# EAGLE schematic Pure VCF (EAGLE 8.7.0)
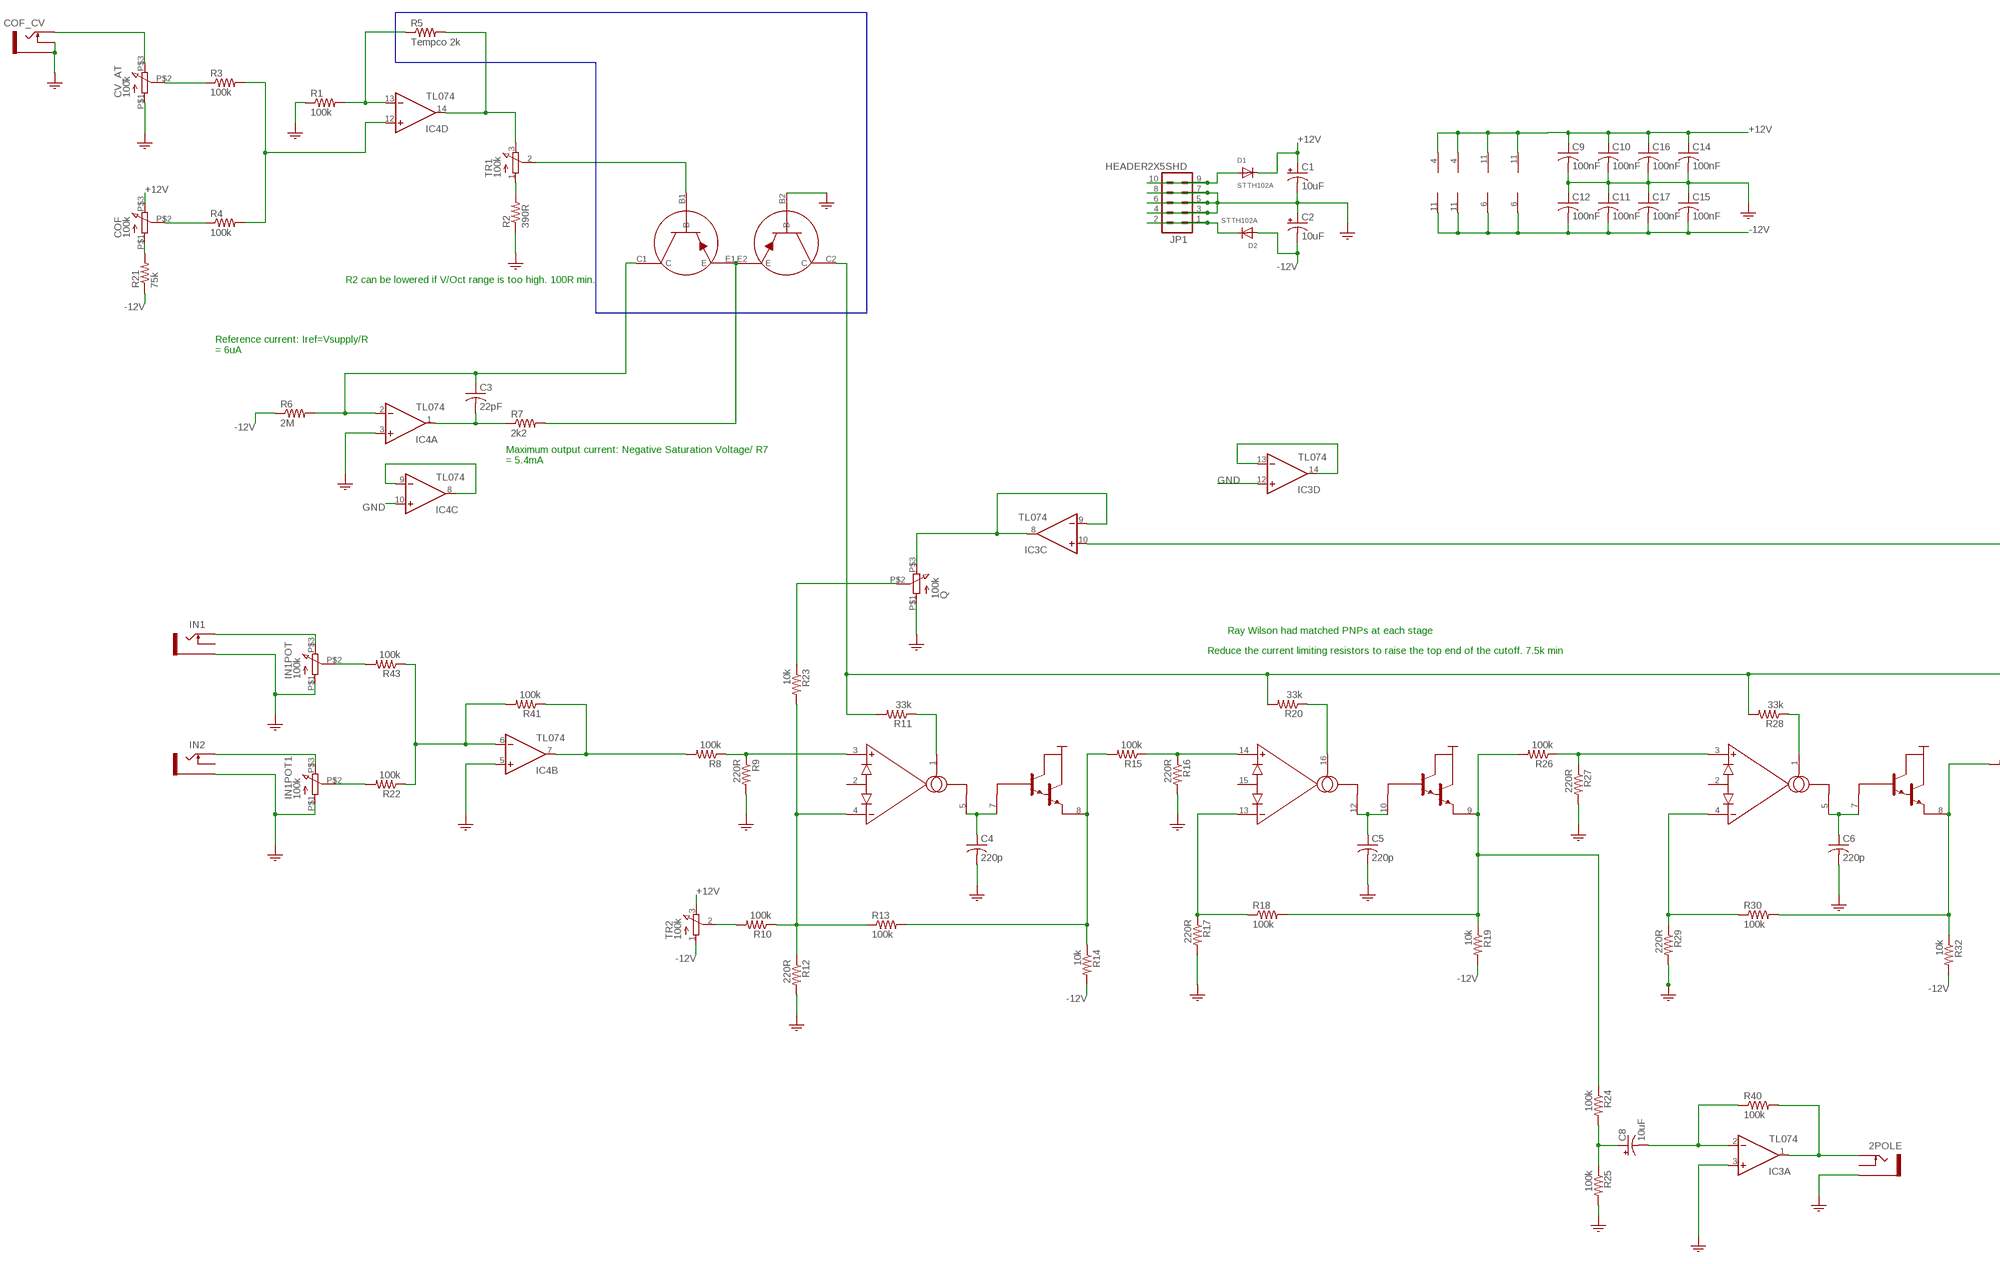
[diagram p0: schematic, sheet 1, part 1 of 2]
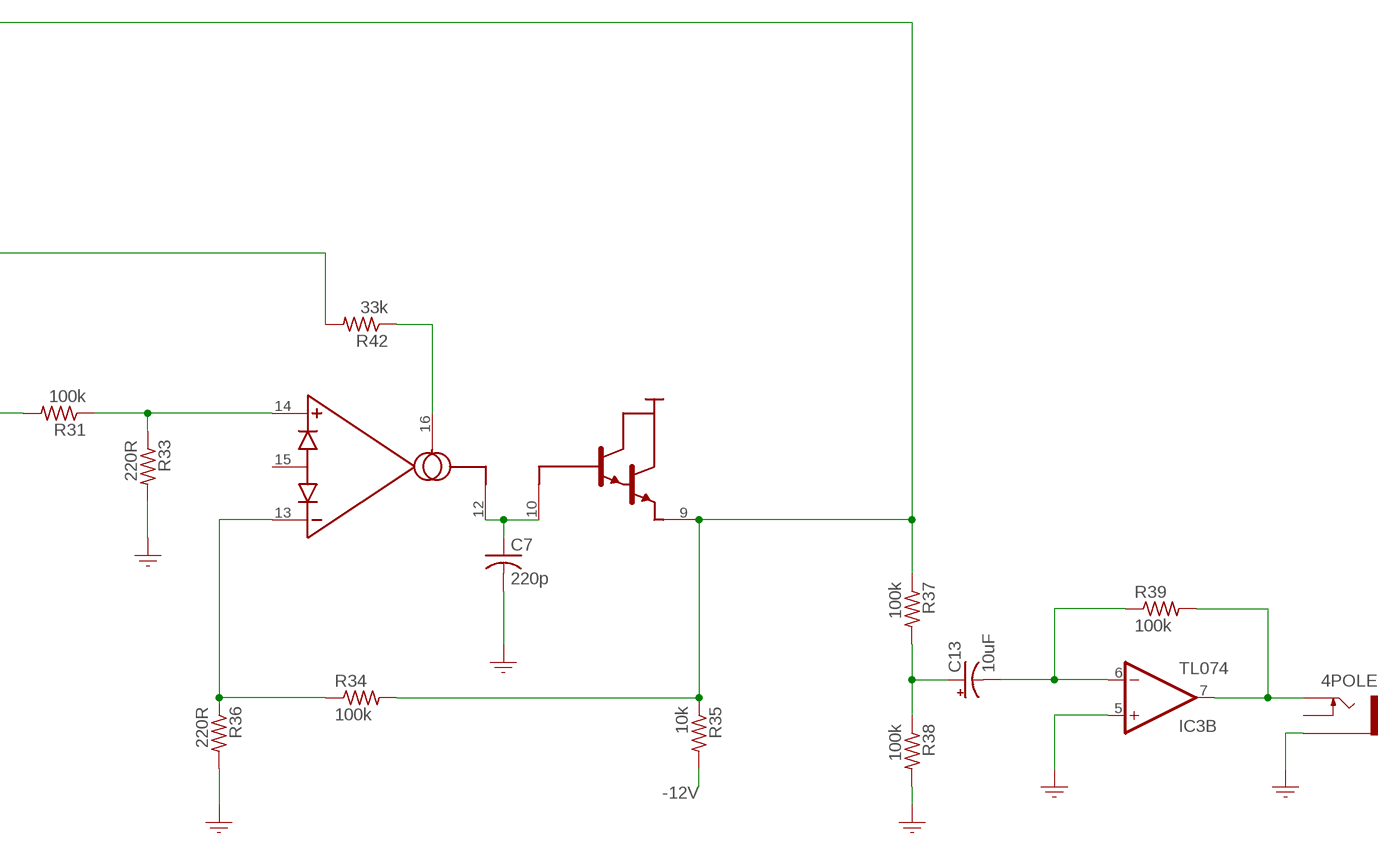
[diagram p1: schematic, sheet 1, part 2 of 2]

## Parts
2POLE  PJ301M-12  SOCKET_MONO_3.5MMPJ301M-12  [PJ301M-12]
4POLE  PJ301M-12  SOCKET_MONO_3.5MMPJ301M-12  [PJ301M-12]
C1  10uF  CAPACITOR_POL-US153CLV-0505  [153CLV-0505]
C2  10uF  CAPACITOR_POL-US153CLV-0505  [153CLV-0505]
C3  22pF  CAPACITOR-USC0805  [C0805]
C4  220p  CAPACITOR-US050-045X075  [C050-045X075]
C5  220p  CAPACITOR-US050-045X075  [C050-045X075]
C6  220p  CAPACITOR-US050-045X075  [C050-045X075]
C7  220p  CAPACITOR-US050-045X075  [C050-045X075]
C8  10uF  CAPACITOR_POL-US153CLV-0505  [153CLV-0505]
C9  100nF  CAPACITOR-USC0805  [C0805]
C10  100nF  CAPACITOR-USC0805  [C0805]
C11  100nF  CAPACITOR-USC0805  [C0805]
C12  100nF  CAPACITOR-USC0805  [C0805]
C13  10uF  CAPACITOR_POL-US153CLV-0505  [153CLV-0505]
C14  100nF  CAPACITOR-USC0805  [C0805]
C15  100nF  CAPACITOR-USC0805  [C0805]
C16  100nF  CAPACITOR-USC0805  [C0805]
C17  100nF  CAPACITOR-USC0805  [C0805]
COF  100k  RESISTOR_VARIABLE9MM_POT  [POTENTIOMETER_9MM]
COF_CV  PJ301M-12  SOCKET_MONO_3.5MMPJ301M-12  [PJ301M-12]
CV_AT  100k  RESISTOR_VARIABLE9MM_POT  [POTENTIOMETER_9MM]
D1  STTH102A  DIODESMA  [SMADIODE]
D2  STTH102A  DIODESMA  [SMADIODE]
IC1  LM13700  OTA_LM13700  [SOIC-16_BLANK]
IC2  LM13700  OTA_LM13700  [SOIC-16_BLANK]
IC3  TL074  OPAMP_QUADD  [SO14]
IC4  TL074  OPAMP_QUADD  [SO14]
IN1  PJ301M-12  SOCKET_MONO_3.5MMPJ301M-12  [PJ301M-12]
IN1POT  100k  RESISTOR_VARIABLE9MM_POT  [POTENTIOMETER_9MM]
IN1POT1  100k  RESISTOR_VARIABLE9MM_POT  [POTENTIOMETER_9MM]
IN2  PJ301M-12  SOCKET_MONO_3.5MMPJ301M-12  [PJ301M-12]
JP1  HEADER2X5SHD  [2X5-SHROUDED]
Q  100k  RESISTOR_VARIABLE9MM_POT  [POTENTIOMETER_9MM]
R1  100k  RESISTOR_USR0805  [R0805]
R2  390R  RESISTOR_USR0805  [R0805]
R3  100k  RESISTOR_USR0805  [R0805]
R4  100k  RESISTOR_USR0805  [R0805]
R5  Tempco 2k  RESISTOR_US0204/7  [0204/7]
R6  2M  RESISTOR_USR0805  [R0805]
R7  2k2  RESISTOR_USR0805  [R0805]
R8  100k  RESISTOR_USR0805  [R0805]
R9  220R  RESISTOR_USR0805  [R0805]
R10  100k  RESISTOR_USR0805  [R0805]
R11  33k  RESISTOR_USR0805  [R0805]
R12  220R  RESISTOR_USR0805  [R0805]
R13  100k  RESISTOR_USR0805  [R0805]
R14  10k  RESISTOR_USR0805  [R0805]
R15  100k  RESISTOR_USR0805  [R0805]
R16  220R  RESISTOR_USR0805  [R0805]
R17  220R  RESISTOR_USR0805  [R0805]
R18  100k  RESISTOR_USR0805  [R0805]
R19  10k  RESISTOR_USR0805  [R0805]
R20  33k  RESISTOR_USR0805  [R0805]
R21  75k  RESISTOR_USR0805  [R0805]
R22  100k  RESISTOR_USR0805  [R0805]
R23  10k  RESISTOR_USR0805  [R0805]
R24  100k  RESISTOR_USR0805  [R0805]
R25  100k  RESISTOR_USR0805  [R0805]
R26  100k  RESISTOR_USR0805  [R0805]
R27  220R  RESISTOR_USR0805  [R0805]
R28  33k  RESISTOR_USR0805  [R0805]
R29  220R  RESISTOR_USR0805  [R0805]
R30  100k  RESISTOR_USR0805  [R0805]
R31  100k  RESISTOR_USR0805  [R0805]
R32  10k  RESISTOR_USR0805  [R0805]
R33  220R  RESISTOR_USR0805  [R0805]
R34  100k  RESISTOR_USR0805  [R0805]
R35  10k  RESISTOR_USR0805  [R0805]
R36  220R  RESISTOR_USR0805  [R0805]
R37  100k  RESISTOR_USR0805  [R0805]
R38  100k  RESISTOR_USR0805  [R0805]
R39  100k  RESISTOR_USR0805  [R0805]
R40  100k  RESISTOR_USR0805  [R0805]
R41  100k  RESISTOR_USR0805  [R0805]
R42  33k  RESISTOR_USR0805  [R0805]
R43  100k  RESISTOR_USR0805  [R0805]
T1  DMMT3906W  TRANSISTOR_PAIR_PNP  [TRANS_PAIR]
TR1  100k  RESISTOR_VARIABLETRIMMER_TH  [TRIMMER_TH]
TR2  100k  RESISTOR_VARIABLETRIMMER_TH  [TRIMMER_TH]

## Nets
+12V: C1.+ C9.1 C10.1 C14.1 C16.1 COF.P$3 D1.C IC1.11(V+) IC2.11(V+) IC3.4(P:V+) IC4.4(P:V+) TR2.3
-12V: C2.- C11.2 C12.2 C15.2 C17.2 D2.A IC1.6(V-) IC2.6(V-) IC3.11(P:V-) IC4.11(P:V-) R6.1 R14.2 R19.2 R21.1 R32.2 R35.2 TR2.1
GND: 2POLE.GND(SLEEVE) 4POLE.GND(SLEEVE) C1.- C2.+ C4.2 C5.2 C6.2 C7.2 C9.2 C10.2 C11.1 C12.1 C14.2 C15.1 C16.2 C17.1 COF_CV.GND(SLEEVE) COF_CV.NORM(SWITCH) CV_AT.P$1 IC3.3(A:+IN) IC3.5(B:+IN) IC3.12(D:+IN) IC4.3(A:+IN) IC4.5(B:+IN) IC4.10(C:+IN) IN1.GND(SLEEVE) IN1POT1.P$1 IN1POT.P$1 IN2.GND(SLEEVE) JP1.3 JP1.4 JP1.5 JP1.6 JP1.7 JP1.8 Q.P$1 R1.1 R2.1 R9.2 R12.2 R16.2 R17.2 R25.2 R27.2 R29.2 R33.2 R36.2 R38.2 T1.B2(B)
N$1: C5.1 IC1.10(BUF-IN_2) IC1.12(OUT)
N$2: T1.B1(B) TR1.2
N$3: R2.2 TR1.1
N$4: IC1.4(IN-) R10.1 R12.1 R13.1 R23.2
N$5: IC4.14(D:OUT) R5.2 TR1.3
N$6: IC4.13(D:-IN) R1.2 R5.1
N$7: COF_CV.TIP CV_AT.P$3
N$8: IC4.12(D:+IN) R3.2 R4.2
N$9: CV_AT.P$2 R3.1
N$10: COF.P$2 R4.1
N$11: C3.1 IC4.2(A:-IN) R6.2 T1.C1(C)
N$12: C3.2 IC4.1(A:OUT) R7.1
N$13: IC1.1(BIAS-IN) R11.1
N$14: R7.2 T1.E1(E) T1.E2(E)
N$15: IC4.6(B:-IN) R22.1 R41.2 R43.1
N$16: IC1.9(BUF-OUT_2) R18.2 R19.1 R24.1 R26.2
N$17: IC1.3(IN+) R8.1 R9.1
N$18: C8.- IC3.2(A:-IN) R40.1
N$19: Q.P$2 R23.1
N$20: IC3.8(C:OUT) IC3.9(C:-IN) Q.P$3
N$21: C13.- IC3.6(B:-IN) R39.1
N$22: IC1.16(BIAS-IN) R20.1
N$23: IC1.14(IN+) R15.1 R16.1
N$24: IC1.13(IN-) R17.1 R18.1
N$25: COF.P$1 R21.2
N$26: C8.+ R24.2 R25.1
N$27: C4.1 IC1.5(OUT) IC1.7(BUF-IN_2)
N$28: IC1.8(BUF-OUT_2) R13.2 R14.1 R15.2
N$29: IC2.3(IN+) R26.1 R27.1
N$30: 2POLE.TIP IC3.1(A:OUT) R40.2
N$31: IC2.16(BIAS-IN) R42.1
N$32: IC4.7(B:OUT) R8.2 R41.1
N$33: IC2.4(IN-) R29.1 R30.1
N$35: R11.2 R20.2 R28.2 R42.2 T1.C2(C)
N$36: C13.+ R37.2 R38.1
N$37: IC3.13(D:-IN) IC3.14(D:OUT)
N$38: D1.A JP1.9 JP1.10
N$39: IC4.8(C:OUT) IC4.9(C:-IN)
N$40: IC2.13(IN-) R34.1 R36.1
N$41: 4POLE.TIP IC3.7(B:OUT) R39.2
N$43: IC2.14(IN+) R31.1 R33.1
N$44: IC2.8(BUF-OUT_2) R30.2 R31.2 R32.1
N$46: IC2.9(BUF-OUT_2) IC3.10(C:+IN) R34.2 R35.1 R37.1
N$47: IN1.TIP IN1POT.P$3
N$49: IN1POT1.P$3 IN2.TIP
N$50: D2.C JP1.1 JP1.2
N$53: IN1POT.P$2 R43.2
N$54: R10.2 TR2.2
N$55: IN1POT1.P$2 R22.2
N$57: C6.1 IC2.5(OUT) IC2.7(BUF-IN_2)
N$58: C7.1 IC2.10(BUF-IN_2) IC2.12(OUT)
N$59: IC2.1(BIAS-IN) R28.1
Unconnected: 2POLE.NORM(SWITCH) 4POLE.NORM(SWITCH) IC1.2(D-BIAS) IC1.15(D-BIAS) IC2.2(D-BIAS) IC2.15(D-BIAS) IN1.NORM(SWITCH) IN2.NORM(SWITCH)

## Buses
B$1

## Notes on the sheet
- R2 can be lowered if V/Oct range is too high. 100R min.
- Reference current: Iref=Vsupply/R
  = 6uA
- Maximum output current: Negative Saturation Voltage/ R7
  = 5.4mA
- Ray Wilson had matched PNPs at each stage
- Reduce the current limiting resistors to raise the top end of the cutoff. 7.5k min

## Library data of the parts
2POLE 4POLE COF_CV IN1 IN2 = GMSN:SOCKET_MONO_3.5MM: 3.5 mm Jack Socket; SORT: 8
C1 C2 C8 C13 = GMSN:CAPACITOR_POL-US: Electro Capacitor; SORT: 6
C3 C9-C12 C14-C17 = GMSN:CAPACITOR-US: Capacitor; SORT: 3
C4-C7 = GMSN:CAPACITOR-US: Capacitor; SORT: 7
COF CV_AT IN1POT IN1POT1 Q = GMSN:RESISTOR_VARIABLE: Potentiometer; SORT: 8
D1 D2 = GMSN:DIODE: Diode SMADIODE - SMA Surface Mount Package 20V 1A Schottky Diode Digikey: 641-1014-6-ND DO-1N4148 - Through Hole Small Current Diode SOD-123 20V 1 A (.5mV Vf) Schottky Diode - Digikey: MBRX120TPMSCT-ND SOD-323 10V 570mA (.38mV Vf, 3ns) Schottky Diode - Digikey: ZLLS410CT-ND SOD-523 30V 30mA Schottky Diode (RB751S-40TE61) - Digikey: RB751S-40TE61CT-ND SOT23-R/W - SOT23 Package (R = Solder Paste/Reflow Ovens, W = Hand-Soldering) BAT54Film 40V 300mA - Digikey: 497-7162-1-ND; SORT: 1
IC1 IC2 = GMSN:OTA_LM13700: LM13700 OTA; SORT: 4
IC3 IC4 = GMSN:OPAMP_QUAD: OP AMP; SORT: 4
JP1 = GMSN:HEADER2X5: Header 5x2 Standard 10-pin dual row 0.1" header. Commonly used with AVR-ISP. Use with Spark Fun Electronics SKU: PRT-00778; SORT: 7
R1-R4 R6-R43 = GMSN:RESISTOR_US: Resistor; SORT: 2
R5 = GMSN:RESISTOR_US: Resistor; SORT: 4
T1 = GMSN:TRANSISTOR_PAIR_PNP: PNP Matched Transistor Pair; SORT: 4
TR1 TR2 = GMSN:RESISTOR_VARIABLE: Potentiometer; SORT: 7